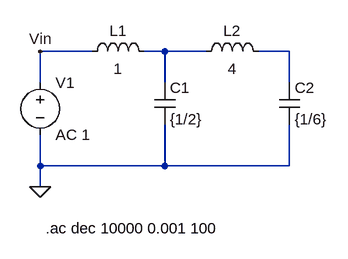
[diagram p0: schematic punto1c.asc]
punto1c.asc, the LTspice schematic file:
Version 4
SHEET 1 1000 760
WIRE 160 112 80 112
WIRE 272 112 240 112
WIRE 336 112 272 112
WIRE 464 112 416 112
WIRE 80 160 80 112
WIRE 272 160 272 112
WIRE 464 160 464 112
WIRE 80 288 80 240
WIRE 272 288 272 224
WIRE 272 288 80 288
WIRE 464 288 464 224
WIRE 464 288 272 288
WIRE 80 320 80 288
FLAG 80 320 0
FLAG 80 112 Vin
SYMBOL voltage 80 144 R0
SYMATTR InstName V1
SYMATTR Value AC 1
SYMBOL ind 144 128 R270
WINDOW 0 32 56 VTop 2
WINDOW 3 5 56 VBottom 2
SYMATTR InstName L1
SYMATTR Value 1
SYMATTR SpiceLine Rser=0 Rpar=1e30
SYMBOL ind 320 128 R270
WINDOW 0 32 56 VTop 2
WINDOW 3 5 56 VBottom 2
SYMATTR InstName L2
SYMATTR Value 4
SYMATTR SpiceLine Rser=0 Rpar=1e30
SYMBOL cap 256 160 R0
SYMATTR InstName C1
SYMATTR Value {1/2}
SYMBOL cap 448 160 R0
SYMATTR InstName C2
SYMATTR Value {1/6}
TEXT 88 384 Left 2 !.ac dec 10000 0.001 100

The netlist it stands for:
* punto1c.asc
V1 Vin 0 AC 1
L1 Vin N001 1 Rser=0 Rpar=1e30
L2 N001 N002 4 Rser=0 Rpar=1e30
C1 N001 0 {1/2}
C2 N002 0 {1/6}
.ac dec 10000 0.001 100
.backanno
.end